# Altium project MP3_player.PrjPcb
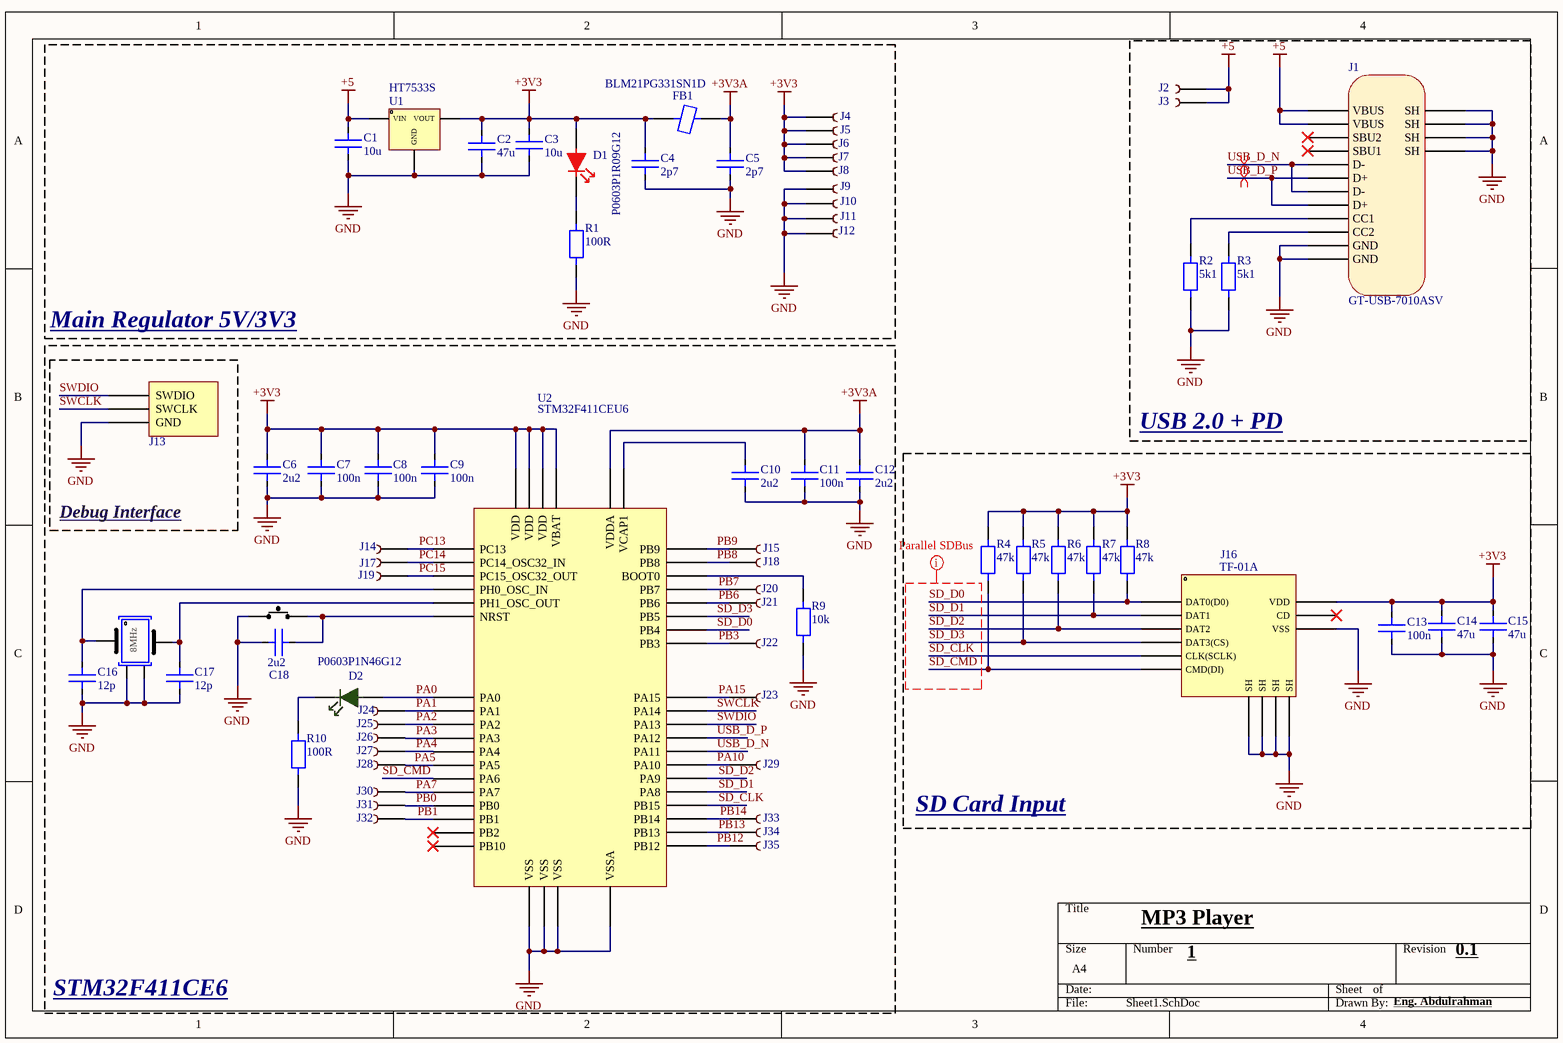
[diagram p0: Sheet1.SchDoc]
1 sheet, 70 parts. Net scope: global (net labels, ports and power ports of the same name join across sheets).
Board file: MP3_Player.PcbDoc

## Sheet Sheet1.SchDoc: MP3 Player
size A4; Date: 15 jan 2026; ApprovedBy: ASJ; CheckedBy: ASJ; CompanyName: conics; DrawnBy: Eng. Abdulrahman; Engineer: Abdulrahman; Organization: conics; Revision: 0.1; SheetNumber: 1; SheetTotal: 1

### Parts
C1  10u  [CAP_MLCC_0805]
C2  47u  [CAP_MLCC_0805]
C3  10u  [CAP_MLCC_0805]
C4  2p7  [CAP_MLCC_0402]
C5  2p7  [CAP_MLCC_0402]
C6  2u2  [CAP_MLCC_0402]
C7  100n  [CAP_MLCC_0402]
C8  100n  [CAP_MLCC_0402]
C9  100n  [CAP_MLCC_0402]
C10  2u2  [CAP_MLCC_0402]
C11  100n  [CAP_MLCC_0402]
C12  2u2  [CAP_MLCC_0402]
C13  100n  [CAP_MLCC_0402]
C14  47u  [CAP_MLCC_0805]
C15  47u  [CAP_MLCC_0805]
C16  12p  [CAP_MLCC_0402]
C17  12p  [CAP_MLCC_0402]
C18  2u2  [CAP_MLCC_0402]
D1  P0603P1R09G12  [LED_0603]
D2  P0603P1N46G12  [LED_0603]
FB1  BLM21PG331SN1D  [FBEAD_0805]
J1  GT-USB-7010ASV  [CONN_CH_USB_SMD_USB]
J2  Castellated Pad  [CPad]  (value not drawn)
J3  Castellated Pad  [CPad]  (value not drawn)
J4  Castellated Pad  [CPad]  (value not drawn)
J5  Castellated Pad  [CPad]  (value not drawn)
J6  Castellated Pad  [CPad]  (value not drawn)
J7  Castellated Pad  [CPad]  (value not drawn)
J8  Castellated Pad  [CPad]  (value not drawn)
J9  Castellated Pad  [CPad]  (value not drawn)
J10  Castellated Pad  [CPad]  (value not drawn)
J11  Castellated Pad  [CPad]  (value not drawn)
J12  Castellated Pad  [CPad]  (value not drawn)
J13  DAP SWD  [CONN_JST_3P]  (value not drawn)
J14  Castellated Pad  [CPad]  (value not drawn)
J15  Castellated Pad  [CPad]  (value not drawn)
J16  TF-01A  [CONN_CH_SMD_SD_CARD]
J17  Castellated Pad  [CPad]  (value not drawn)
J18  Castellated Pad  [CPad]  (value not drawn)
J19  Castellated Pad  [CPad]  (value not drawn)
J20  Castellated Pad  [CPad]  (value not drawn)
J21  Castellated Pad  [CPad]  (value not drawn)
J22  Castellated Pad  [CPad]  (value not drawn)
J23  Castellated Pad  [CPad]  (value not drawn)
J24  Castellated Pad  [CPad]  (value not drawn)
J25  Castellated Pad  [CPad]  (value not drawn)
J26  Castellated Pad  [CPad]  (value not drawn)
J27  Castellated Pad  [CPad]  (value not drawn)
J28  Castellated Pad  [CPad]  (value not drawn)
J29  Castellated Pad  [CPad]  (value not drawn)
J30  Castellated Pad  [CPad]  (value not drawn)
J31  Castellated Pad  [CPad]  (value not drawn)
J32  Castellated Pad  [CPad]  (value not drawn)
J33  Castellated Pad  [CPad]  (value not drawn)
J34  Castellated Pad  [CPad]  (value not drawn)
J35  Castellated Pad  [CPad]  (value not drawn)
R1  100R  [RES_SMD_0402]
R2  5k1  [RES_SMD_0402]
R3  5k1  [RES_SMD_0402]
R4  47k  [RES_SMD_0402]
R5  47k  [RES_SMD_0402]
R6  47k  [RES_SMD_0402]
R7  47k  [RES_SMD_0402]
R8  47k  [RES_SMD_0402]
R9  10k  [RES_SMD_0402]
R10  100R  [RES_SMD_0402]
SW1  TS-1088-AR02016  [SW_SMD_SPST]  (value not drawn)
U1  HT7533S  [HT7533S_SOT23]
U2  STM32F411CEU6  [STM32F411CEU6_QFPN48]
X1  XC32M4-8.000-F12LJDT  [XTAL_SMD_HCL]  (value not drawn)

### Blocks framed on the sheet
Main Regulator 5V/3V3: C1-C5 D1 FB1 J4-J12 R1 U1
USB 2.0 + PD: J1-J3 R2 R3
STM32F411CE6: C6-C12 C16-C18 D2 J14 J15 J17-J35 R9 R10 SW1 U2 X1
Debug Interface: J13
SD Card Input: C13-C15 J16 R4-R8

### Nets
+3V3: C2.2 C3.2 C4.2 C6.2 C7.2 C8.2 C9.2 C13.2 C14.2 C15.2 D1.2 FB1.1 J4.1 J5.1 J6.1 J7.1 J8.1 J16.4(VDD) R4.2 R5.2 R6.2 R7.2 R8.2 U1.3(VOUT) U2.1(VBAT) U2.24(VDD) U2.36(VDD) U2.48(VDD)
+3V3A: C5.2 C11.2 C12.2 FB1.2 U2.9(VDDA)
+5: C1.2 J1.1(VBUS) J1.2(VBUS) J2.1 J3.1 U1.2(VIN)
GND: C1.1 C2.1 C3.1 C4.1 C5.1 C6.1 C7.1 C8.1 C9.1 C10.1 C11.1 C12.1 C13.1 C14.1 C15.1 C16.1 C17.1 C18.2 J1.11(GND) J1.12(GND) J1.13(SH) J1.14(SH) J1.15(SH) J1.16(SH) J9.1 J10.1 J11.1 J12.1 J13.3(GND) J16.6(VSS) J16.10(SH) J16.11(SH) J16.12(SH) J16.13(SH) R1.2 R2.1 R3.1 R9.1 R10.1 SW1.1 U1.1(GND) U2.8(VSSA) U2.23(VSS) U2.35(VSS) U2.47(VSS) X1.2 X1.4
PA0: D2.2 U2.10(PA0)
PA1: J24.1 U2.11(PA1)
PA2: J25.1 U2.12(PA2)
PA3: J26.1 U2.13(PA3)
PA4: J27.1 U2.14(PA4)
PA5: J28.1 U2.15(PA5)
PA7: J30.1 U2.17(PA7)
PA10: J29.1 U2.31(PA10)
PA15: J23.1 U2.38(PA15)
PB0: J31.1 U2.18(PB0)
PB1: J32.1 U2.19(PB1)
PB3: J22.1 U2.39(PB3)
PB6: J21.1 U2.42(PB6)
PB7: J20.1 U2.43(PB7)
PB8: J18.1 U2.45(PB8)
PB9: J15.1 U2.46(PB9)
PB12: J35.1 U2.25(PB12)
PB13: J34.1 U2.26(PB13)
PB14: J33.1 U2.27(PB14)
PC13: J14.1 U2.2(PC13)
PC14: J17.1 U2.3(PC14_OSC32_IN)
PC15: J19.1 U2.4(PC15_OSC32_OUT)
SD_CLK: J16.5(CLK(SCLK)) U2.28(PB15)
SD_CMD: J16.3(CMD(DI)) R4.1 U2.16(PA6)
SD_D0: J16.7(DAT0(D0)) R8.1 U2.40(PB4)
SD_D1: J16.8(DAT1) R7.1 U2.29(PA8)
SD_D2: J16.1(DAT2) R6.1 U2.30(PA9)
SD_D3: J16.2(DAT3(CS)) R5.1 U2.41(PB5)
SWCLK: J13.2(SWCLK) U2.37(PA14)
SWDIO: J13.1(SWDIO) U2.34(PA13)
USB_D_N: J1.5(D-) J1.7(D-) U2.32(PA11)
USB_D_P: J1.6(D+) J1.8(D+) U2.33(PA12)
NetC10_2: C10.2 U2.22(VCAP1)
NetC16_2: C16.2 U2.5(PH0_OSC_IN) X1.1
NetC17_2: C17.2 U2.6(PH1_OSC_OUT) X1.3
NetC18_1: C18.1 SW1.2 U2.7(NRST)
NetD1_1: D1.1 R1.1
NetD2_1: D2.1 R10.2
NetJ1_4: J1.4(CC1) R2.2
NetJ1_10: J1.10(CC2) R3.2
NetR9_2: R9.2 U2.44(BOOT0)

Not connected (* = marked no-connect by the designer): J1 3(SBU2)* 9(SBU1)*; J16 9(CD)*; U2 20(PB2)* 21(PB10)*

### Layout directives
net class SD Bus: SD_CLK, SD_CMD, SD_D0, SD_D1, SD_D2, SD_D3
differential pair: USB_D_N, USB_D_P

### Notes on the sheet
- (in symbol Crystal SMD 8MHz) 8MHz

### Library data of the parts
C1-C3 C14 C15 = Cap MLCC 0805: Multilayer  Ceramic Capacitor
C4 C5 = Cap MLCC 0402: Multilayer  Ceramic Capacitor; Manufacturer 1: *; Manufacturer Part Number 1: *; Quantity: *
C6-C13 C16-C18 = Cap MLCC 0402: Multilayer  Ceramic Capacitor; Designator: C?; Manufacturer 1: *; Manufacturer Part Number 1: *; Quantity: *
D1 = Diode LED R: 20mA 350mcd 621nm Red 2V 0603 LED Indication - Discrete ROHS; Manufacturer 1: Silverlight; Manufacturer Part Number 1: P0603P1R09G12; Quantity: *; ComponentLink1Description: Product Link; ComponentLink1URL: https://www.lcsc.com/product-detail/C5123549.html; ComponentLink2Description: Datasheet; ComponentLink2URL: https://www.lcsc.com/datasheet/C5123549.pdf
D2 = Diode LED G: 1200mcd 518nm~524nm Green 3V 0603 LED Indication - Discrete ROHS; Manufacturer 1: Silverlight; Designator: D?; Manufacturer Part Number 1: P0603P1N46G12; Quantity: *; ComponentLink1Description: Datasheet; ComponentLink1URL: https://www.lcsc.com/datasheet/C5123548.pdf; ComponentLink2Description: Product Link; ComponentLink2URL: https://www.lcsc.com/product-detail/C5123548.html
FB1 = Filter Ferrite Bead 0805: 70mΩ ±25% 330Ω@100MHz 0805 Ferrite Beads and Chips RoHS; Manufacturer 1: muRata; Manufacturer Part Number 1: BLM21PG331SN1D; Quantity: *
J1 = Connector USB-C CH: USB 2.0 1 16P -40℃~+85℃ Type-C SMD USB, DVI, HDMI Connector Assemblies ROHS; Manufacturer 1: G-Switch; Manufacturer Part Number 1: GT-USB-7010ASV; Quantity: *; ComponentLink1Description: Datasheet; ComponentLink1URL: https://atta.szlcsc.com/upload/public/pdf/source/20230327/DF227B64686AC8FA0AD1775797F2C3F1.pdf; ComponentLink2Description: Product Link; ComponentLink2URL: https://www.lcsc.com/product-detail/C2988369.html
J13 = DAP SWD: Connector Header 3 position 1mm Pitch 1A Surface Mount,Vertical -25℃~+85℃; Manufacturer 1: JST; Manufacturer Part Number 1: BM03B-SRSS-TB(LF)(SN); Designator: J?; Quantity: *; ComponentLink1Description: Datasheet; ComponentLink1URL: https://www.lcsc.com/datasheet/C160389.pdf; ComponentLink2Description: Product Link; ComponentLink2URL: https://www.lcsc.com/product-detail/C160389.html
J16 = Connector SD Card CH: Push-Push 1.85mm Connector and Ejector MicroSD Card (TF Card) SMD PC Card Sockets ROHS; Manufacturer 1: Korean Hroparts Elec; Manufacturer Part Number 1: TF-01A; Quantity: *; ComponentLink1Description: Datasheet; ComponentLink1URL: https://www.lcsc.com/datasheet/C91145.pdf; ComponentLink2Description: Product Link; ComponentLink2URL: https://www.lcsc.com/product-detail/C91145.html
R1-R3 = Resistor 0402: General Purpose SMD Carbon Resistor; Manufacturer 1: *; Manufacturer Part Number 1: *; Quantity: *
R4-R10 = Resistor 0402: General Purpose SMD Carbon Resistor; Designator: R?; Manufacturer 1: *; Manufacturer Part Number 1: *; Quantity: *
SW1 = Switch SMD SPST: Without Bracket 4mm 12V 3mm Round Button SPST 50mA SMD,4x3mm Tactile Switches ROHS; Manufacturer 1: XUNPU; Designator: SW?; Manufacturer Part Number 1: TS-1088-AR02016; Quantity: *; ComponentLink1Description: Datasheet; ComponentLink1URL: https://item.szlcsc.com/datasheet/TS-1088-AR02016/763484.html?lcsc_vid=T1EMVlBfE1BXVVADFQQNUlMFT1RXUAZeFlhfBlAAQVExVlNQR1lZUlJWR1BfVTsOAxUeFF5JWBEcCEoDFhIXAgAHWQIBCks%3D; ComponentLink2Description: Product Link; ComponentLink2URL: https://www.lcsc.com/product-detail/C720477.html
U1 = Regulator LDO HT7533S: Linear Voltage Regulator IC Positive Fixed 1 Output 100mA SOT-23; Manufacturer 1: UMW; Manufacturer Part Number 1: HT7533S; ComponentLink1Description: Product Link; ComponentLink1URL: https://www.lcsc.com/product-detail/C347215.html; ComponentLink2Description: Datasheet; ComponentLink2URL: https://www.lcsc.com/datasheet/C347215.pdf
U2 = MCU STM32F411CEU6: ARM Cortex-M4 32 Bit 100MHz 36 UFQFPN-48(7x7) Microcontrollers RoHS; Manufacturer 1: ST; Manufacturer Part Number 1: STM32F411CEU6; Quantity: *; ComponentLink1Description: Datasheet; ComponentLink1URL: https://www.lcsc.com/datasheet/C60420.pdf; ComponentLink2Description: Product Link; ComponentLink2URL: https://www.lcsc.com/product-detail/C60420.html
X1 = Crystal SMD 8MHz: Crystal Oscillator 12pF SMD3225-4P Crystals RoHS; Manufacturer 1: HCI; Designator: X?; Manufacturer Part Number 1: XC32M4-8.000-F12LJDT; Quantity: *; ComponentLink1Description: Datasheet; ComponentLink1URL: https://www.lcsc.com/datasheet/C2842191.pdf; ComponentLink2Description: Product Link; ComponentLink2URL: https://www.lcsc.com/product-detail/C2842191.html